# Altium schematic sheet Sensors.SchDoc
size A4; SheetNumber: 11; SheetTotal: 11
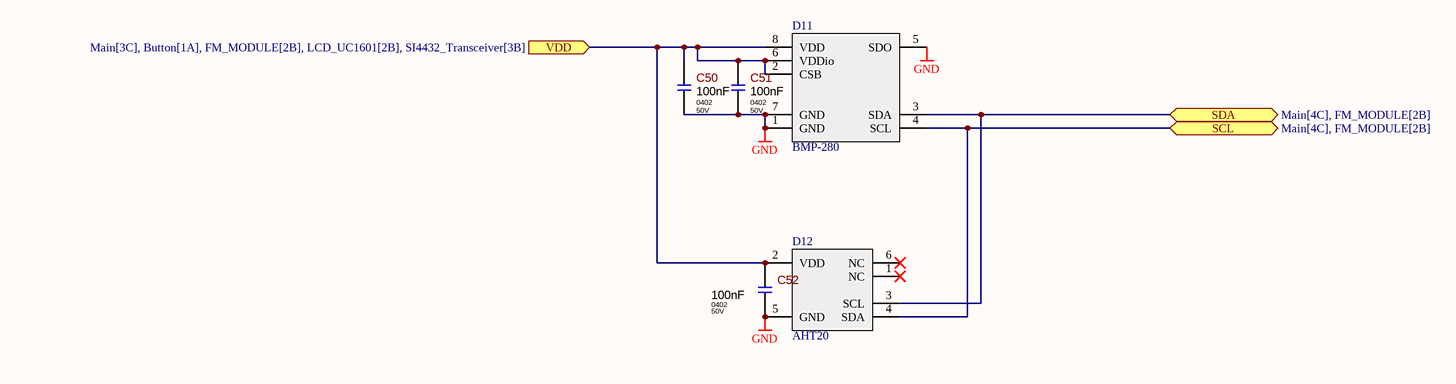
[diagram p0: Sensors.SchDoc]

## Parts
C50  Package: 0402  Voltage: 50V  [Cap_0402]  (hidden comment: 100nF)
C51  Package: 0402  Voltage: 50V  [Cap_0402]  (hidden comment: 100nF)
C52  Package: 0402  Voltage: 50V  [Cap_0402]  (hidden comment: 100nF)
D11  BMP-280  [BMP-280]
D12  AHT20  [AHT20]

## Ports
SCL (bidir, see Main[4C], FM_MODULE[2B]), SDA (bidir, see Main[4C], FM_MODULE[2B]), VDD (in, see Main[3C], Button[1A], FM_MODULE[2B], LCD_UC1601[2B], SI4432_Transceiver[3B])

## Nets
GND: C50.2 C51.2 C52.2 D11.1(GND) D11.5(SDO) D11.7(GND) D12.5(GND)
SCL: D11.4(SCL) D12.4(SDA) ; port SCL
SDA: D11.3(SDA) D12.3(SCL) ; port SDA
VDD: C50.1 C51.1 C52.1 D11.2(CSB) D11.6(VDDio) D11.8(VDD) D12.2(VDD) ; port VDD

Not connected (* = marked no-connect by the designer): D12 1(NC)* 6(NC)*

## Library data of the parts
C50-C52 = Cap_0402_100nF: 100nF 50V  ±25% 0402 Ceramic Capacitor; Component Type: SMD; Tolerance: ±25%; ComponentLink1URL: https://search.murata.co.jp/Ceramy/image/img/A01X/G101/ENG/GRM31CR60J107ME39-01.pdf; ComponentLink1Description: Datasheet; Value: 100nF
D12 = AHT20: Temperature and humidity sensor -40+85 0-100% / 1.8-3.3v; Name: AHT20